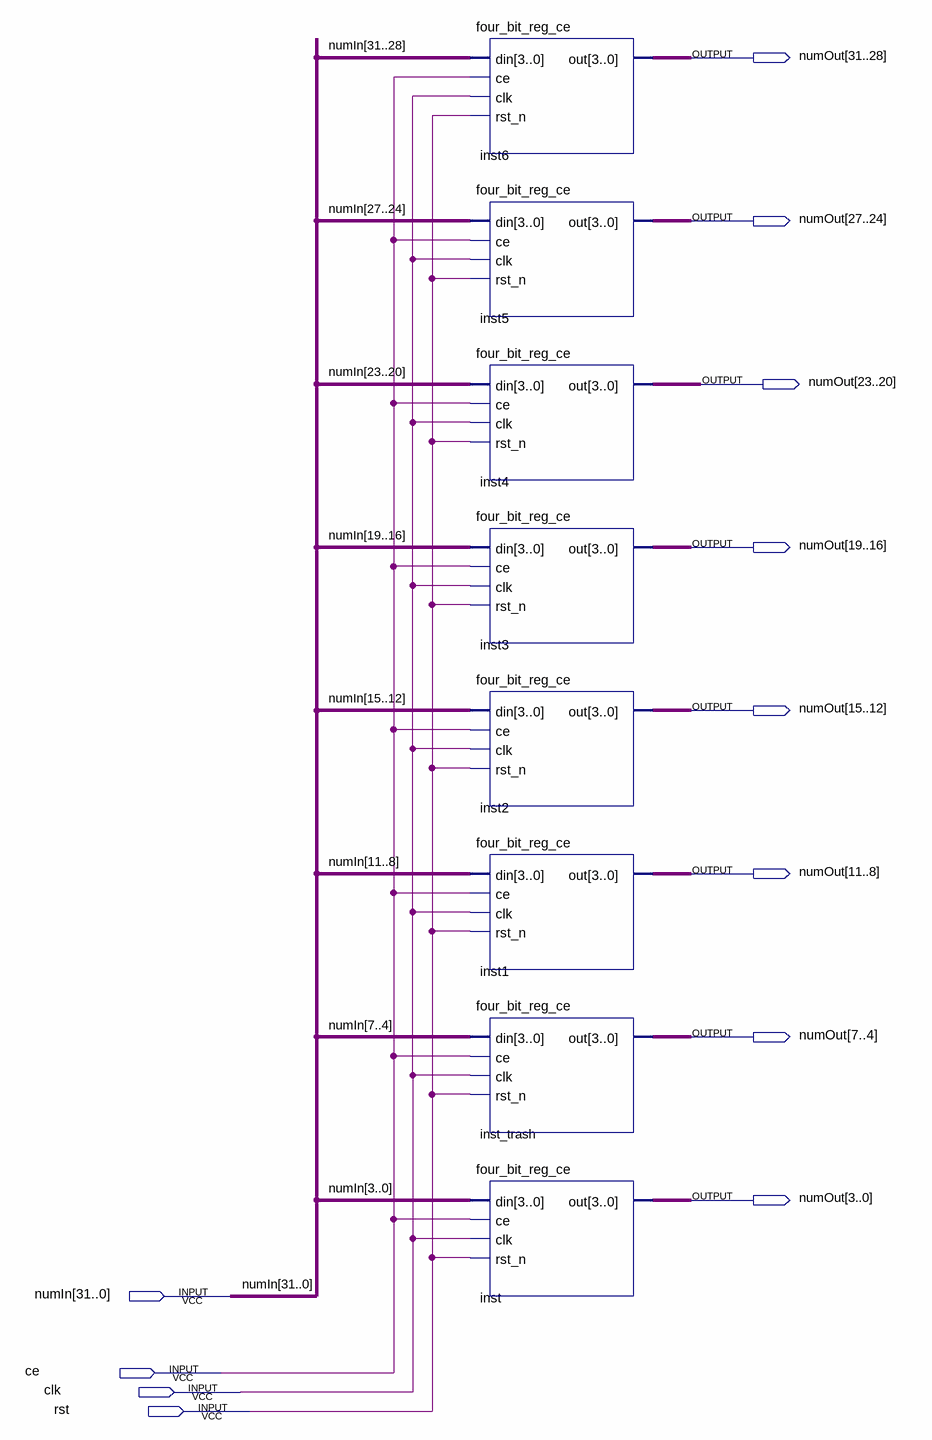
[diagram p0: schematic sheet]
// Quartus schematic four_eight_bit_reg.bdf as structural Verilog: 8 symbols, 12 pins
module four_eight_bit_reg (
  input  [31:0] numIn,
  input  ce,
  input  clk,
  input  rst,
  output [31:0] numOut
);

  four_bit_reg_ce inst6 (.din(numIn[31:28]), .ce(ce), .clk(clk), .rst_n(rst), .out(numOut[31:28]));
  four_bit_reg_ce inst5 (.din(numIn[27:24]), .ce(ce), .clk(clk), .rst_n(rst), .out(numOut[27:24]));
  four_bit_reg_ce inst4 (.din(numIn[23:20]), .ce(ce), .clk(clk), .rst_n(rst), .out(numOut[23:20]));
  four_bit_reg_ce inst3 (.din(numIn[19:16]), .ce(ce), .clk(clk), .rst_n(rst), .out(numOut[19:16]));
  four_bit_reg_ce inst2 (.din(numIn[15:12]), .ce(ce), .clk(clk), .rst_n(rst), .out(numOut[15:12]));
  four_bit_reg_ce inst1 (.din(numIn[11:8]), .ce(ce), .clk(clk), .rst_n(rst), .out(numOut[11:8]));
  four_bit_reg_ce inst_trash (.din(numIn[7:4]), .ce(ce), .clk(clk), .rst_n(rst), .out(numOut[7:4]));
  four_bit_reg_ce inst (.din(numIn[3:0]), .ce(ce), .clk(clk), .rst_n(rst), .out(numOut[3:0]));
endmodule
